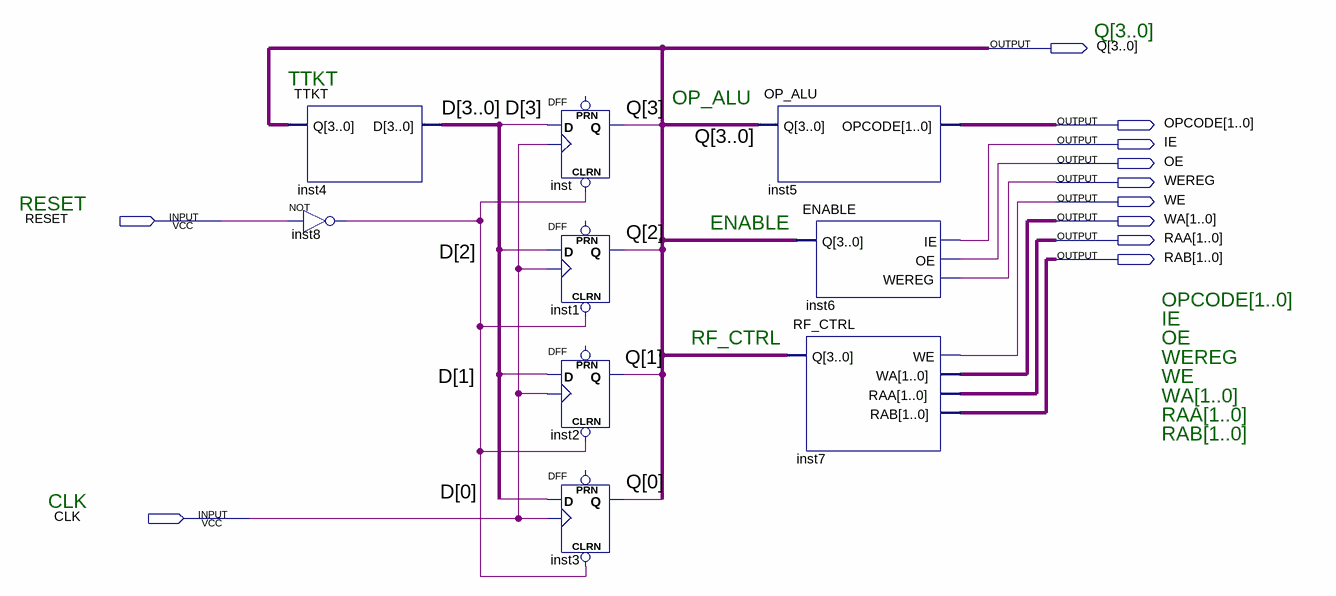
[diagram p0: schematic sheet]
// Quartus schematic CONTROL.bdf as structural Verilog: 9 symbols, 11 pins
module CONTROL (
  input  RESET,
  input  CLK,
  output [3:0] Q,
  output [1:0] OPCODE,
  output IE,
  output OE,
  output WEREG,
  output WE,
  output [1:0] WA,
  output [1:0] RAA,
  output [1:0] RAB
);

  wire inst8_out;
  wire [3:0] D;

  TTKT inst4 (.Q(Q), .D(D));
  not inst8 (inst8_out, RESET);
  DFF inst (.CLRN(inst8_out), .CLK(CLK), .D(D[3]), .Q(Q[3]));  // open: PRN
  DFF inst1 (.CLRN(inst8_out), .CLK(CLK), .D(D[2]), .Q(Q[2]));  // open: PRN
  DFF inst2 (.CLRN(inst8_out), .CLK(CLK), .D(D[1]), .Q(Q[1]));  // open: PRN
  DFF inst3 (.CLRN(inst8_out), .CLK(CLK), .D(D[0]), .Q(Q[0]));  // open: PRN
  OP_ALU inst5 (.Q(Q), .OPCODE(OPCODE));
  ENABLE inst6 (.Q(Q), .IE(IE), .OE(OE), .WEREG(WEREG));
  RF_CTRL inst7 (.Q(Q), .WE(WE), .WA(WA), .RAA(RAA), .RAB(RAB));

  // Notes on the sheet:
  //   Q[3..0]
  //   TTKT
  //   OP_ALU
  //   RESET
  //   ENABLE
  //   OPCODE[1..0]
  //   IE
  //   RF_CTRL
  //   OE
  //   WEREG
  //   WE
  //   WA[1..0]
  //   RAA[1..0]
  //   RAB[1..0]
  //   CLK
endmodule
